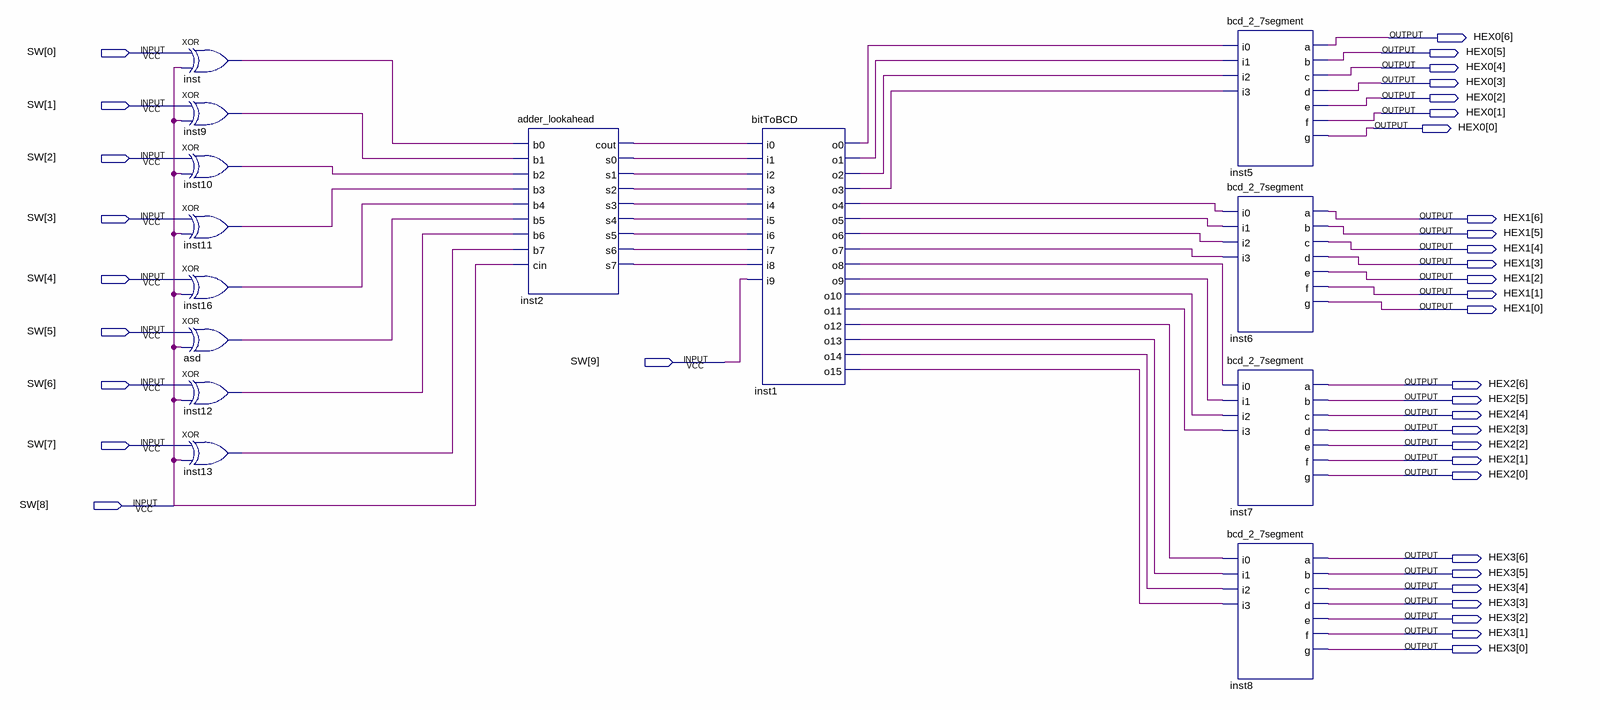
[diagram p0: schematic sheet]
// Quartus schematic adder_pronto123.bdf as structural Verilog: 14 symbols, 38 pins
module adder_pronto123 (
  input  [9:0] SW,
  output [6:0] HEX0,
  output [6:0] HEX1,
  output [6:0] HEX2,
  output [6:0] HEX3
);

  wire asd_out, inst1_o0, inst1_o1, inst1_o2, inst1_o3, inst1_o4, inst1_o5, inst1_o6, inst1_o7, inst1_o8,
       inst1_o9, inst1_o10, inst1_o11, inst1_o12, inst1_o13, inst1_o14, inst1_o15, inst2_cout, inst2_s0,
       inst2_s1, inst2_s2, inst2_s3, inst2_s4, inst2_s5, inst2_s6, inst2_s7, inst9_out, inst10_out,
       inst11_out, inst12_out, inst13_out, inst16_out, inst_out;

  xor inst (inst_out, SW[0], SW[8]);
  xor inst9 (inst9_out, SW[1], SW[8]);
  xor inst10 (inst10_out, SW[2], SW[8]);
  xor inst11 (inst11_out, SW[3], SW[8]);
  xor inst16 (inst16_out, SW[4], SW[8]);
  xor asd (asd_out, SW[5], SW[8]);
  xor inst12 (inst12_out, SW[6], SW[8]);
  xor inst13 (inst13_out, SW[7], SW[8]);
  adder_lookahead inst2 (
    .b0(inst_out), .b1(inst9_out), .b2(inst10_out), .b3(inst11_out), .b4(inst16_out), .b5(asd_out),
    .b6(inst12_out), .b7(inst13_out), .cin(SW[8]), .cout(inst2_cout), .s0(inst2_s0), .s1(inst2_s1),
    .s2(inst2_s2), .s3(inst2_s3), .s4(inst2_s4), .s5(inst2_s5), .s6(inst2_s6), .s7(inst2_s7));
  bitToBCD inst1 (
    .i0(inst2_cout), .i1(inst2_s0), .i2(inst2_s1), .i3(inst2_s2), .i4(inst2_s3), .i5(inst2_s4),
    .i6(inst2_s5), .i7(inst2_s6), .i8(inst2_s7), .i9(SW[9]), .o0(inst1_o0), .o1(inst1_o1), .o2(inst1_o2),
    .o3(inst1_o3), .o4(inst1_o4), .o5(inst1_o5), .o6(inst1_o6), .o7(inst1_o7), .o8(inst1_o8), .o9(inst1_o9),
    .o10(inst1_o10), .o11(inst1_o11), .o12(inst1_o12), .o13(inst1_o13), .o14(inst1_o14), .o15(inst1_o15));
  bcd_2_7segment inst5 (
    .i0(inst1_o0), .i1(inst1_o1), .i2(inst1_o2), .i3(inst1_o3), .a(HEX0[6]), .b(HEX0[5]), .c(HEX0[4]),
    .d(HEX0[3]), .e(HEX0[2]), .f(HEX0[1]), .g(HEX0[0]));
  bcd_2_7segment inst6 (
    .i0(inst1_o4), .i1(inst1_o5), .i2(inst1_o6), .i3(inst1_o7), .a(HEX1[6]), .b(HEX1[5]), .c(HEX1[4]),
    .d(HEX1[3]), .e(HEX1[2]), .f(HEX1[1]), .g(HEX1[0]));
  bcd_2_7segment inst7 (
    .i0(inst1_o8), .i1(inst1_o9), .i2(inst1_o10), .i3(inst1_o11), .a(HEX2[6]), .b(HEX2[5]), .c(HEX2[4]),
    .d(HEX2[3]), .e(HEX2[2]), .f(HEX2[1]), .g(HEX2[0]));
  bcd_2_7segment inst8 (
    .i0(inst1_o12), .i1(inst1_o13), .i2(inst1_o14), .i3(inst1_o15), .a(HEX3[6]), .b(HEX3[5]), .c(HEX3[4]),
    .d(HEX3[3]), .e(HEX3[2]), .f(HEX3[1]), .g(HEX3[0]));
endmodule
